# EAGLE design Load (EAGLE 5.04)
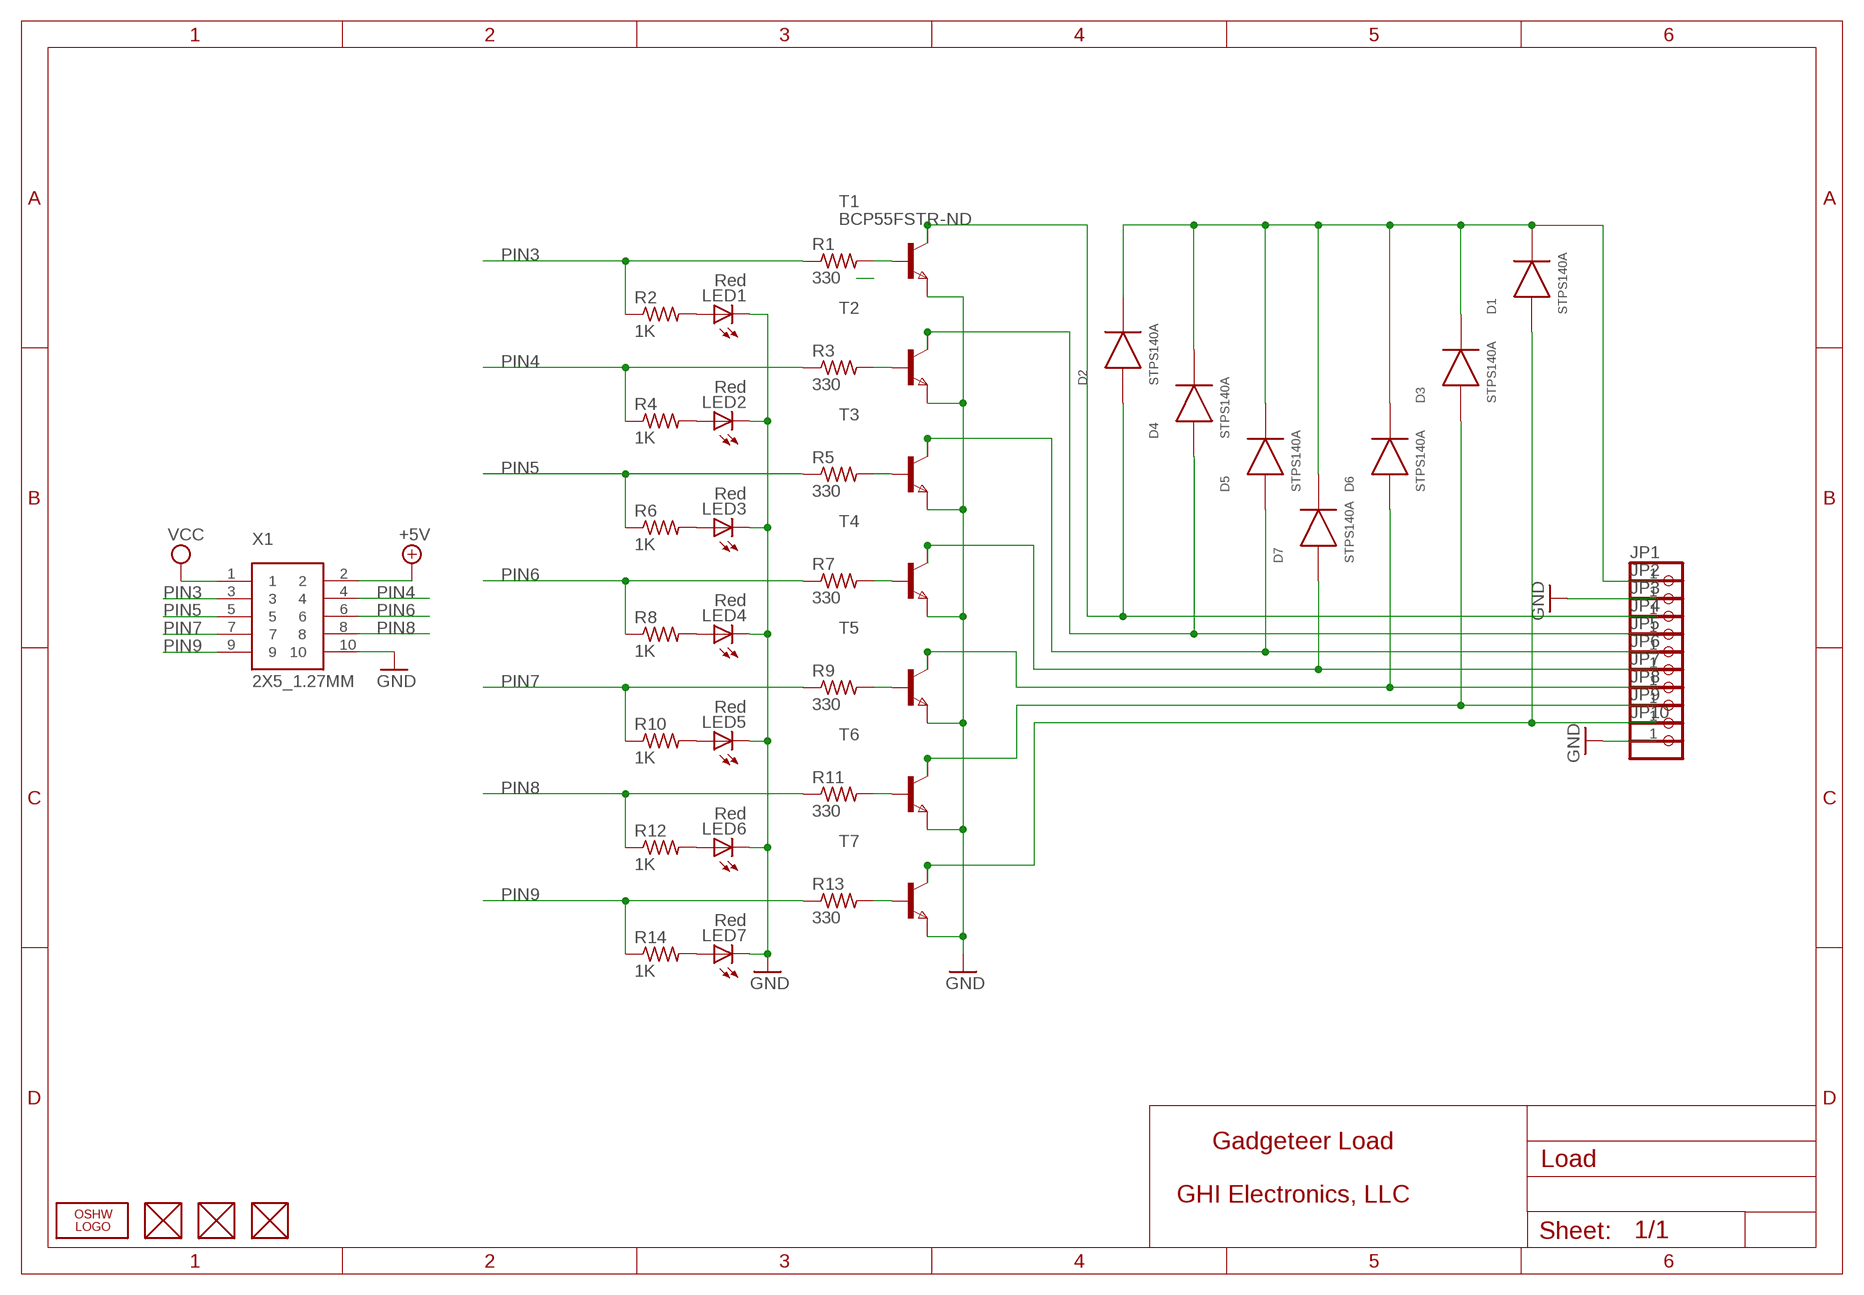
[diagram p0: schematic, sheet 1]

## Parts
D1  STPS140A  DIODE_SMA  [DIODE_SMA]
D2  STPS140A  DIODE_SMA  [DIODE_SMA]
D3  STPS140A  DIODE_SMA  [DIODE_SMA]
D4  STPS140A  DIODE_SMA  [DIODE_SMA]
D5  STPS140A  DIODE_SMA  [DIODE_SMA]
D6  STPS140A  DIODE_SMA  [DIODE_SMA]
D7  STPS140A  DIODE_SMA  [DIODE_SMA]
FUD1  FIDUCIAL  [FIDUCIAL_40MIL]
FUD2  FIDUCIAL  [FIDUCIAL_40MIL]
FUD3  FIDUCIAL  [FIDUCIAL_40MIL]
JP1  PINHD-1X1  [1X01]
JP2  PINHD-1X1  [1X01]
JP3  PINHD-1X1  [1X01]
JP4  PINHD-1X1  [1X01]
JP5  PINHD-1X1  [1X01]
JP6  PINHD-1X1  [1X01]
JP7  PINHD-1X1  [1X01]
JP8  PINHD-1X1  [1X01]
JP9  PINHD-1X1  [1X01]
JP10  PINHD-1X1  [1X01]
LED1  Red  LEDCHIPLED_0805  [CHIPLED_0805]
LED2  Red  LEDCHIPLED_0805  [CHIPLED_0805]
LED3  Red  LEDCHIPLED_0805  [CHIPLED_0805]
LED4  Red  LEDCHIPLED_0805  [CHIPLED_0805]
LED5  Red  LEDCHIPLED_0805  [CHIPLED_0805]
LED6  Red  LEDCHIPLED_0805  [CHIPLED_0805]
LED7  Red  LEDCHIPLED_0805  [CHIPLED_0805]
LOGO1  LOGO-OSHW-FILLX0200-NT  [OSHW_FILLX200_NOTEXT]
R1  330  R-US_R0603  [R0603]
R2  1K  R-US_R0603  [R0603]
R3  330  R-US_R0603  [R0603]
R4  1K  R-US_R0603  [R0603]
R5  330  R-US_R0603  [R0603]
R6  1K  R-US_R0603  [R0603]
R7  330  R-US_R0603  [R0603]
R8  1K  R-US_R0603  [R0603]
R9  330  R-US_R0603  [R0603]
R10  1K  R-US_R0603  [R0603]
R11  330  R-US_R0603  [R0603]
R12  1K  R-US_R0603  [R0603]
R13  330  R-US_R0603  [R0603]
R14  1K  R-US_R0603  [R0603]
T1  BCP55FSTR-ND  NPNSOT223  [SOT223]
T2  NPNSOT223  [SOT223]
T3  NPNSOT223  [SOT223]
T4  NPNSOT223  [SOT223]
T5  NPNSOT223  [SOT223]
T6  NPNSOT223  [SOT223]
T7  NPNSOT223  [SOT223]
X1  2X5_1.27MM  [2X5_1.27MM]

## Nets
+5V [power]: X1.2
GND [power]: JP2.1 JP10.1 LED1.C LED2.C LED3.C LED4.C LED5.C LED6.C LED7.C T1.3(E) T2.3(E) T3.3(E) T4.3(E) T5.3(E) T6.3(E) T7.3(E) X1.10
N$1: R1.2 T1.1(B)
N$2: R5.2 T3.1(B)
N$3: R7.2 T4.1(B)
N$4: D2.A JP3.1 T1.2(C1) T1.4(C2)
N$5: D4.A JP4.1 T2.2(C1) T2.4(C2)
N$6: D5.A JP5.1 T3.2(C1) T3.4(C2)
N$7: D7.A JP6.1 T4.2(C1) T4.4(C2)
N$8: D6.A JP7.1 T5.2(C1) T5.4(C2)
N$9: D3.A JP8.1 T6.2(C1) T6.4(C2)
N$10: D1.A JP9.1 T7.2(C1) T7.4(C2)
N$11: R9.2 T5.1(B)
N$12: R3.2 T2.1(B)
N$13: R11.2 T6.1(B)
N$14: R13.2 T7.1(B)
N$15: D1.K D2.K D3.K D4.K D5.K D6.K D7.K JP1.1
N$17: LED1.A R2.2
N$18: LED2.A R4.2
N$19: LED3.A R6.2
N$20: LED4.A R8.2
N$21: LED5.A R10.2
N$22: LED6.A R12.2
N$23: LED7.A R14.2
PIN3: R1.1 R2.1 X1.3
PIN4: R3.1 R4.1 X1.4
PIN5: R5.1 R6.1 X1.5
PIN6: R7.1 R8.1 X1.6
PIN7: R9.1 R10.1 X1.7
PIN8: R11.1 R12.1 X1.8
PIN9: R13.1 R14.1 X1.9
VCC [power]: X1.1
Unconnected: FUD1.P$1 FUD2.P$1 FUD3.P$1

## Notes on the sheet
- Gadgeteer Load
- GHI Electronics, LLC

## Library data of the parts
D1-D7 = GHI:DIODE_SMA
FUD1-FUD3 = GHI:FIDUCIAL
JP1-JP10 = pinhead:PINHD-1X1: PIN HEADER
LED1-LED7 = led:LED: LED OSRAM: - CHIPLED LG R971, LG N971, LY N971, LG Q971, LY Q971, LO R971, LY R971 LH N974, LH R974 LS Q976, LO Q976, LY Q976 LO Q996 - Hyper CHIPLED LW Q18S LB Q993, LB Q99A, LB R99A - SideLED LS A670, LO A670, LY A670, LG A670, LP A670 LB A673, LV A673, LT A673, LW A673 LH A674 LY A675 LS A676, LA A676, LO A676, LY A676, LW A676 LS A679, LY A679, LG A679 - Hyper Micro SIDELED® LS Y876, LA Y876, LO Y876, LY Y876 LT Y87S - SmartLED LW L88C, LW L88S LB L89C, LB L89S, LG L890 LS L89K, LO L89K, LY L89K LS L896, LA L896, LO L896, LY L896 - TOPLED LS T670, LO T670, LY T670, LG T670, LP T670 LSG T670, LSP T670, LSY T670, LOP T670, LYG T670 LG T671, LOG T671, LSG T671 LB T673, LV T673, LT T673, LW T673 LH T674 LS T676, LA T676, LO T676, LY T676, LB T676, LH T676, LSB T676, LW T676 LB T67C, LV T67C, LT T67C, LS T67K, LO T67K, LY T67K, LW E67C LS E67B, LA E67B, LO E67B, LY E67B, LB E67C, LV E67C, LT E67C LW T67C LS T679, LY T679, LG T679 LS T770, LO T770, LY T770, LG T770, LP T770 LB T773, LV T773, LT T773, LW T773 LH T774 LS E675, LA E675, LY E675, LS T675 LS T776, LA T776, LO T776, LY T776, LB T776 LHGB T686 LT T68C, LB T68C - Hyper Mini TOPLED® LB M676 - Mini TOPLED Santana® LG M470 LS M47K, LO M47K, LY M47K Source: http://www.osram.convergy.de LUXEON: - LUMILED® LXK2-PW12-R00, LXK2-PW12-S00, LXK2-PW14-U00, LXK2-PW14-V00 LXK2-PM12-R00, LXK2-PM12-S00, LXK2-PM14-U00 LXK2-PE12-Q00, LXK2-PE12-R00, LXK2-PE12-S00, LXK2-PE14-T00, LXK2-PE14-U00 LXK2-PB12-K00, LXK2-PB12-L00, LXK2-PB12-M00, LXK2-PB14-N00, LXK2-PB14-P00, LXK2-PB14-Q00 LXK2-PR12-L00, LXK2-PR12-M00, LXK2-PR14-Q00, LXK2-PR14-R00 LXK2-PD12-Q00, LXK2-PD12-R00, LXK2-PD12-S00 LXK2-PH12-R00, LXK2-PH12-S00 LXK2-PL12-P00, LXK2-PL12-Q00, LXK2-PL12-R00 Source: www.luxeon.com KINGBRIGHT: KA-3528ASYC Source: www.kingbright.com
LOGO1 = Logo:LOGO-OSHW-FILL
R1-R14 = rcl:R-US_: RESISTOR, American symbol
T1-T7 = zetex:NPNSOT223: NPN TRANSISTOR
X1 = GHI:2X5_1.27MM

## Board
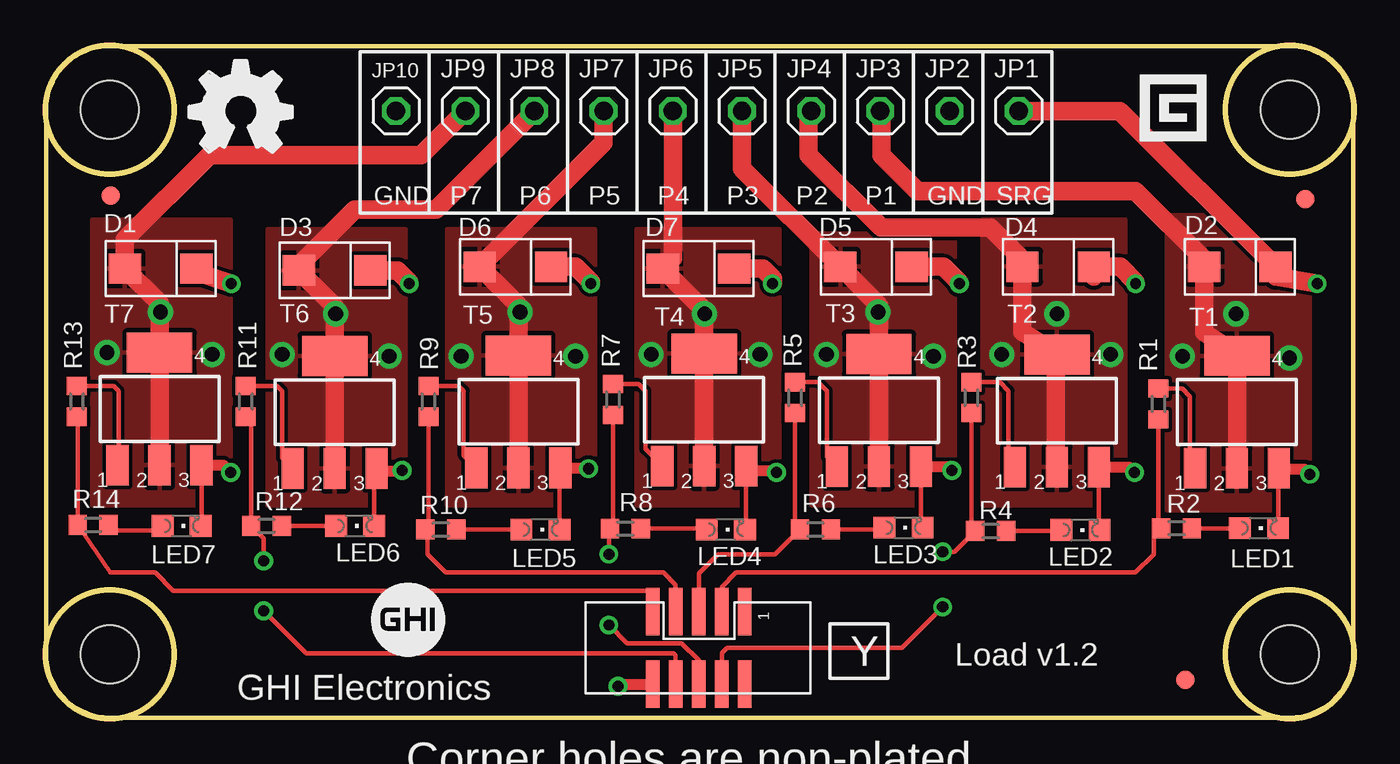
[diagram p1: board, top side]
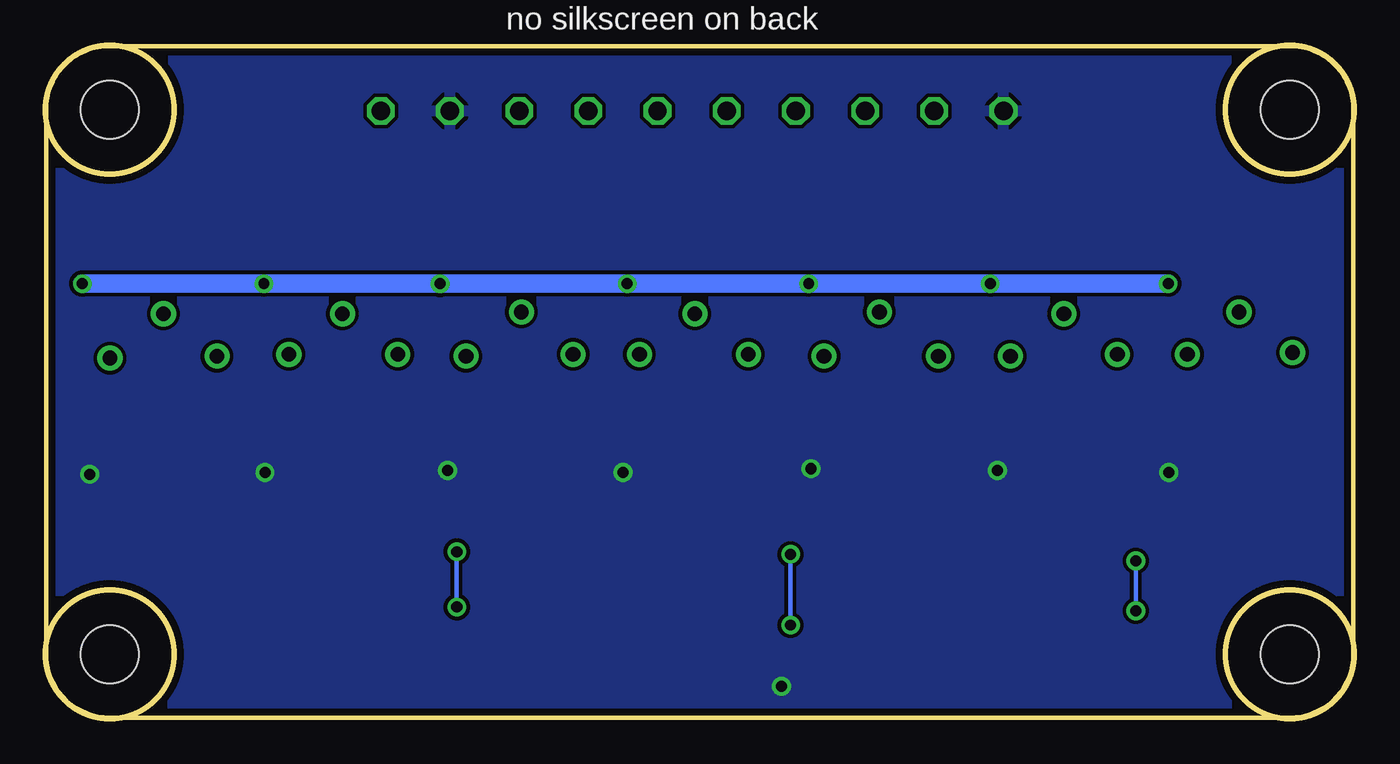
[diagram p2: board, bottom side, seen from below]

Size 72.07 x 37.07 mm. Coordinates in mm from the lower left corner, seen from the top.
Outline: 68.54,0.04 arc90 72.04,3.54 72.04,33.54 arc90 68.54,37.04 3.54,37.04 arc90 0.04,33.54 0.04,3.54 arc90 3.54,0.04 68.54,0.04
Outline: circle at 68.54,3.54 radius 3.54
Outline: circle at 3.54,3.54 radius 3.54
Outline: circle at 3.54,33.54 radius 3.54
Outline: circle at 68.54,33.54 radius 3.54
Copper layers (1+16): Top 0.035mm / dielectric 1.5mm / Bottom 0.035mm
Design rules: minimum track width 8mil, minimum drill 12mil, track to track 8mil, track to pad 8mil, pad to pad 8mil, via to via 8mil, smd to smd 8mil, copper to edge 15mil, drill to drill 8mil, minimum pad ring 10mil, minimum via ring 7mil, stop-mask expansion 4mil, vias tented up to drill 50mil, thermal gap 10mil
Holes 3.2 mm at 3.54,3.54 68.54,3.54 3.54,33.54 68.54,33.54

### Footprints (pad centres in the part's own frame; a part is rotated, then mirrored left to right if it is on the bottom)
DIODE_SMA = smd 1.778 x 1.676: A -1.905,0; K 2.032,0
FIDUCIAL_40MIL = smd 1.016 x 1.016: P$1 0,0
1X01 = drill 1.016 octagon: 1 0,0
CHIPLED_0805 = smd 1.2 x 1.2: A 0,-1.05; C 0,1.05
R0603 = smd 1 x 1.1: 1 -0.85,0; 2 0.85,0
SOT223 = smd 1.219 x 2.235: 1 -2.311,-3.099; 2 0,-3.099; 3 2.311,-3.099 | smd 3.6 x 2.2: 4 0,3.099
2X5_1.27MM = smd 2.6 x 0.74: 1 -2,2.58; 2 2,2.58; 3 -2,1.31; 4 2,1.31; 5 -2,0.04; 6 2,0.04; 7 -2,-1.23; 8 2,-1.23; 9 -2,-2.5; 10 2,-2.5

### Placement (x,y rotation side)
D1  6.28,24.78 0 top
D2  65.71,24.88 0 top
D3  15.86,24.67 0 top
D4  55.7,24.88 0 top
D5  45.68,24.88 0 top
D6  25.82,24.88 0 top
D7  35.9,24.78 0 top
FUD1  69.38,28.6 0 top
FUD2  62.77,2.12 0 top
FUD3  3.61,28.8 0 top
JP1  53.6,33.46 0 top
JP2  49.79,33.46 0 top
JP3  45.98,33.46 0 top
JP4  42.17,33.46 0 top
JP5  38.36,33.46 0 top
JP6  34.55,33.46 0 top
JP7  30.74,33.46 0 top
JP8  26.93,33.46 0 top
JP9  23.12,33.46 0 top
JP10  19.31,33.46 0 top
LED1  66.83,10.47 270 top
LED2  57.01,10.37 270 top
LED3  47.26,10.5 270 top
LED4  37.48,10.4 270 top
LED5  27.26,10.4 270 top
LED6  17.05,10.6 270 top
LED7  7.5,10.6 270 top
LOGO1  7.92,31.17 0 top
R1  61.3,17.32 90 top
R2  62.29,10.47 0 top
R3  50.99,17.67 90 top
R4  52.05,10.32 0 top
R5  41.29,17.67 90 top
R6  42.4,10.4 0 top
R7  31.25,17.56 90 top
R8  31.94,10.45 0 top
R9  21.09,17.46 90 top
R10  21.78,10.4 0 top
R11  11.03,17.46 90 top
R12  12.18,10.6 0 top
R13  1.74,17.46 90 top
R14  2.63,10.65 0 top
T1  65.62,16.87 0 top
T2  55.71,16.94 0 top
T3  45.9,16.97 0 top
T4  36.28,16.99 0 top
T5  26.05,16.89 0 top
T6  15.94,16.87 0 top
T7  6.28,17.04 0 top
X1  35.94,3.88 270 top

### Tracks (layer width: path | path; a pad name or v marks a point on that pad's centre or on a via)
GND  (via drill 0.61)
  Top 0.254: T7.3 8.6,10.64 LED7.C | LED6.C 18.1,13.62 T6.3 | 38.59,13.65 38.59,10.47 LED4.C | T3.3 48.21,10.59 LED3.C | T2.3 58.02,10.41 LED2.C | LED1.C 67.88,13.73 T1.3 | LED5.C 28.31,13.75 T5.3
  Top 0.61: X1.10 31.65,1.88 v31.53,1.76 | T4.3 38.59,13.65 40.17,13.65 v40.27,13.55 | 18.1,13.62 19.62,13.62 v19.64,13.65 | T5.3 29.86,13.79 v29.91,13.75 | T3.3 49.7,13.87 v49.92,13.65 | T2.3 59.68,13.84 v59.98,13.55 | 67.88,13.73 69.35,13.73 v69.63,13.45 | T7.3 9.8,13.95 v10.2,13.55
  pour Bottom: 0.14,0.04 71.66,0.04 71.87,36.92 0.34,36.92
N$1
  Top 0.254: R1.2 62.6,18.17 63.04,17.73 63.04,14.05 T1.1
N$2
  Top 0.254: R5.2 42.56,18.52 43.04,18.04 43.04,14.43 T3.1
N$3
  Top 0.254: R7.2 32.66,18.41 33.04,18.04 33.04,14.83 T4.1
N$4  (via drill 0.81)
  Top 0.406: T1.4 65.04,19.97 65.65,20.04
  Top 1.016: T1.2 65.65,14.36 65.65,20.04 63.81,21.26 D2.A 63.81,25.26 60.04,29.04 48.04,29.04 46.04,31.04 46.04,33.4 JP3.1
  other vias: 62.62,19.95 68.51,19.85 65.57,22.29
  pour Top: 61.76,11.47 69.63,11.47 69.63,27.72 61.76,27.72
N$5  (via drill 0.81)
  Top 0.406: T2.4 55.04,20.04 55.65,20.14
  Top 1.016: T2.2 55.65,14.62 55.65,20.14 53.8,21.27 D4.A 53.8,25.27 52.04,27.04 46.04,27.04 42.04,31.04 42.04,33.32 JP4.1
  other vias: 55.71,22.29 52.66,20.05 58.66,20.05
  pour Top: 51.6,11.72 59.47,11.72 59.47,27.47 51.6,27.47
N$6  (via drill 0.81)
  Top 1.016: JP5.1 38.36,30.29 D5.A 45.9,22.75 45.9,22.39 T3.4 T3.2
  other vias: 43.01,20.05 45.86,22.39 48.91,19.95
  pour Top: 42.2,11.72 50.07,11.72 50.07,26.71 42.2,26.71
N$7  (via drill 0.81)
  Top 1.016: JP6.1 34.55,25.33 D7.A 36.28,22.49 36.28,22.18 T4.4 T4.2
  other vias: 33.36,20.05 36.31,22.29 39.35,20.05
  pour Top: 32.55,11.72 40.42,11.72 40.42,26.96 32.55,26.96
N$8  (via drill 0.81)
  Top 1.016: JP7.1 30.74,31.71 D6.A 26.05,22.74 26.05,21.68 T5.4 T5.2
  other vias: 22.9,19.95 26.15,22.39 29.19,19.95
  pour Top: 22.13,11.72 30.26,11.72 30.26,26.96 22.13,26.96
N$9  (via drill 0.81)
  Top 1.016: JP8.1 21.51,28.04 17.04,28.04 13.95,24.95 D3.A 15.94,22.69 15.94,22.49 T6.4 T6.2
  other vias: 13.04,20.05 15.99,22.29 18.93,19.95
  pour Top: 12.23,11.72 19.85,11.72 19.85,26.96 12.23,26.96
N$10  (via drill 0.81)
  Top 1.016: JP9.1 20.7,31.04 9.04,31.04 4.38,26.38 D1.A 6.28,22.87 6.28,22.29 T7.4 T7.2
  other vias: 3.39,20.15 6.33,22.39 9.18,20.05
  pour Top: 2.58,11.72 10.2,11.72 10.2,27.47 2.58,27.47
N$11
  Top 0.254: R9.2 22.76,18.31 23.04,18.04 23.04,14.49 T5.1
N$12
  Top 0.254: R3.2 52.56,18.52 53.04,18.04 53.04,14.2 T2.1
N$13
  Top 0.254: R11.2 12.76,18.31 13.04,18.04 13.04,14.36 T6.1
N$14
  Top 0.254: R13.2 3.76,18.31 4.04,18.04 4.04,14.01 T7.1
N$15  (via drill 0.6, 0.61)
  Top 1.016: 57.74,24.33 D4.K 59.19,24.88 60.04,24.04 v60.04,23.94 | JP1.1 59.16,33.46 D2.K 67.75,24.32 v70.04,23.94 | v40.04,23.94 40.07,23.97 40.07,24.22 39.51,24.78 D7.K | D1.K 8.42,24.57 v10.24,23.94 | D3.K 19.4,24.67 20.04,24.04 v20.04,23.94 | D6.K 29.19,24.88 30.04,24.04 v30.04,23.94 | D5.K 49.46,24.88 50.33,24.01 v50.33,23.94
  Bottom 1.016: v10.24,23.94 v20.04,23.94 v30.04,23.94 v40.04,23.94 v50.33,23.94 v60.04,23.94 v70.04,23.94
N$17
  Top 0.254: R2.2 LED1.A
N$18
  Top 0.254: R4.2 55.91,10.32 LED2.A
N$19
  Top 0.254: R6.2 46.11,10.4 LED3.A
N$20
  Top 0.254: R8.2 36.37,10.45 LED4.A
N$21
  Top 0.254: R10.2 LED5.A
N$22
  Top 0.254: R12.2 LED6.A
N$23
  Top 0.254: R14.2 3.7,10.69 3.75,10.34 6.09,10.34 LED7.A
PIN3
  Top 0.254: X1.3 37.25,7.25 38.04,8.04 60.04,8.04 61.04,9.04 61.04,10.07 R2.1 61.3,10.62 R1.1
PIN4  (via drill 0.61)
  Top 0.254: R3.1 50.99,10.54 R4.1 | R4.1 51.34,10.18 | X1.4 37.25,3.62 37.53,3.9 47.18,3.9 v49.41,6.13 | v49.41,9.18 50.06,9.18 R4.1
  Bottom 0.254: v49.41,6.13 v49.41,9.18
PIN5
  Top 0.254: X1.5 35.98,7.98 37.04,9.04 40.19,9.04 R6.1 41.29,10.67 R5.1
PIN6  (via drill 0.6)
  Top 0.254: X1.6 35.98,3.19 35.04,4.14 32.04,4.14 v31.04,5.14 | v31.04,9.04 31.04,10.4 R8.1 31.25,10.61 R7.1
  Bottom 0.254: v31.04,5.14 v31.04,9.04
PIN7
  Top 0.254: X1.7 34.71,7.36 34.04,8.04 22.04,8.04 21.04,9.04 21.04,10.29 R10.1 21.09,10.56 R9.1
PIN8  (via drill 0.61)
  Top 0.254: R11.1 11.33,16.61 R12.1 12.02,9.9 v12.02,8.67 | X1.8 34.71,3.46 34.58,3.59 14.36,3.59 v12.02,5.93
  Bottom 0.254: v12.02,5.93 v12.02,8.67
PIN9
  Top 0.254: X1.9 33.44,6.73 33.04,7.04 7.04,7.04 6.04,8.04 3.58,8.04 R14.1 1.79,10.54 1.79,16.22 1.85,16.52 R13.1

### Text on the board
tPlace: GND | P7 | P6 | P5 | P4 | P3 | P2 | P1 | GND | SRG | Y | Load v1.2 | GHI Electronics | Corner holes are non-plated | black PCB with white text | do not add manufacturing codes
bPlace: no silkscreen on back